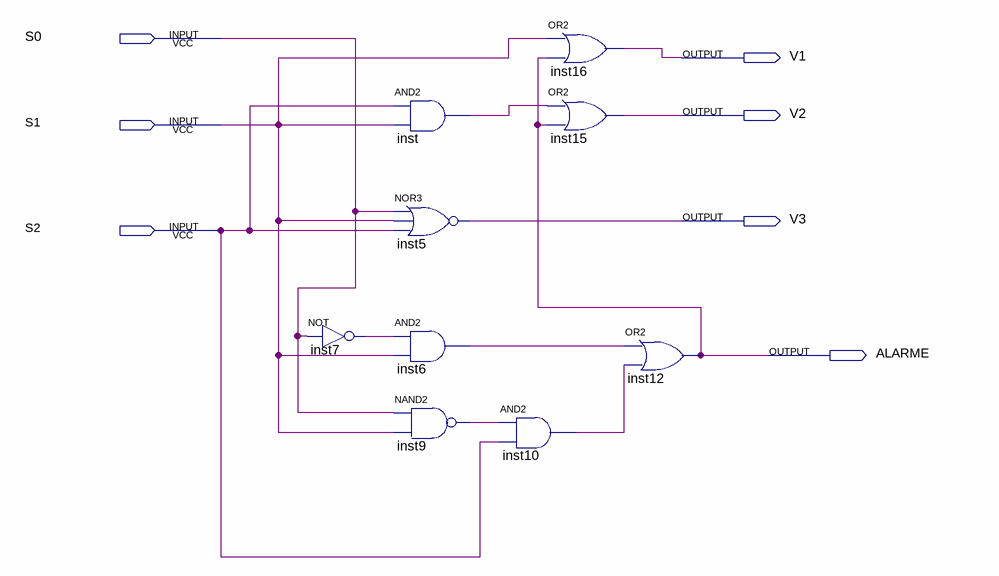
[diagram p0: schematic sheet]
// Quartus schematic Aula02.bdf as structural Verilog: 9 symbols, 7 pins
module Aula02 (
  input  S0,
  input  S1,
  input  S2,
  output V1,
  output V2,
  output V3,
  output ALARME
);

  wire inst6_out, inst7_out, inst9_out, inst10_out, inst_out;

  not inst7 (inst7_out, S0);
  and inst (inst_out, S2, S1);
  nor inst5 (V3, S0, S1, S2);
  and inst6 (inst6_out, inst7_out, S1);
  nand inst9 (inst9_out, S0, S1);
  and inst10 (inst10_out, inst9_out, S2);
  or inst16 (V1, S1, ALARME);
  or inst15 (V2, inst_out, ALARME);
  or inst12 (ALARME, inst6_out, inst10_out);
endmodule
